# Altium schematic sheet 测试板.SchDoc
size A2
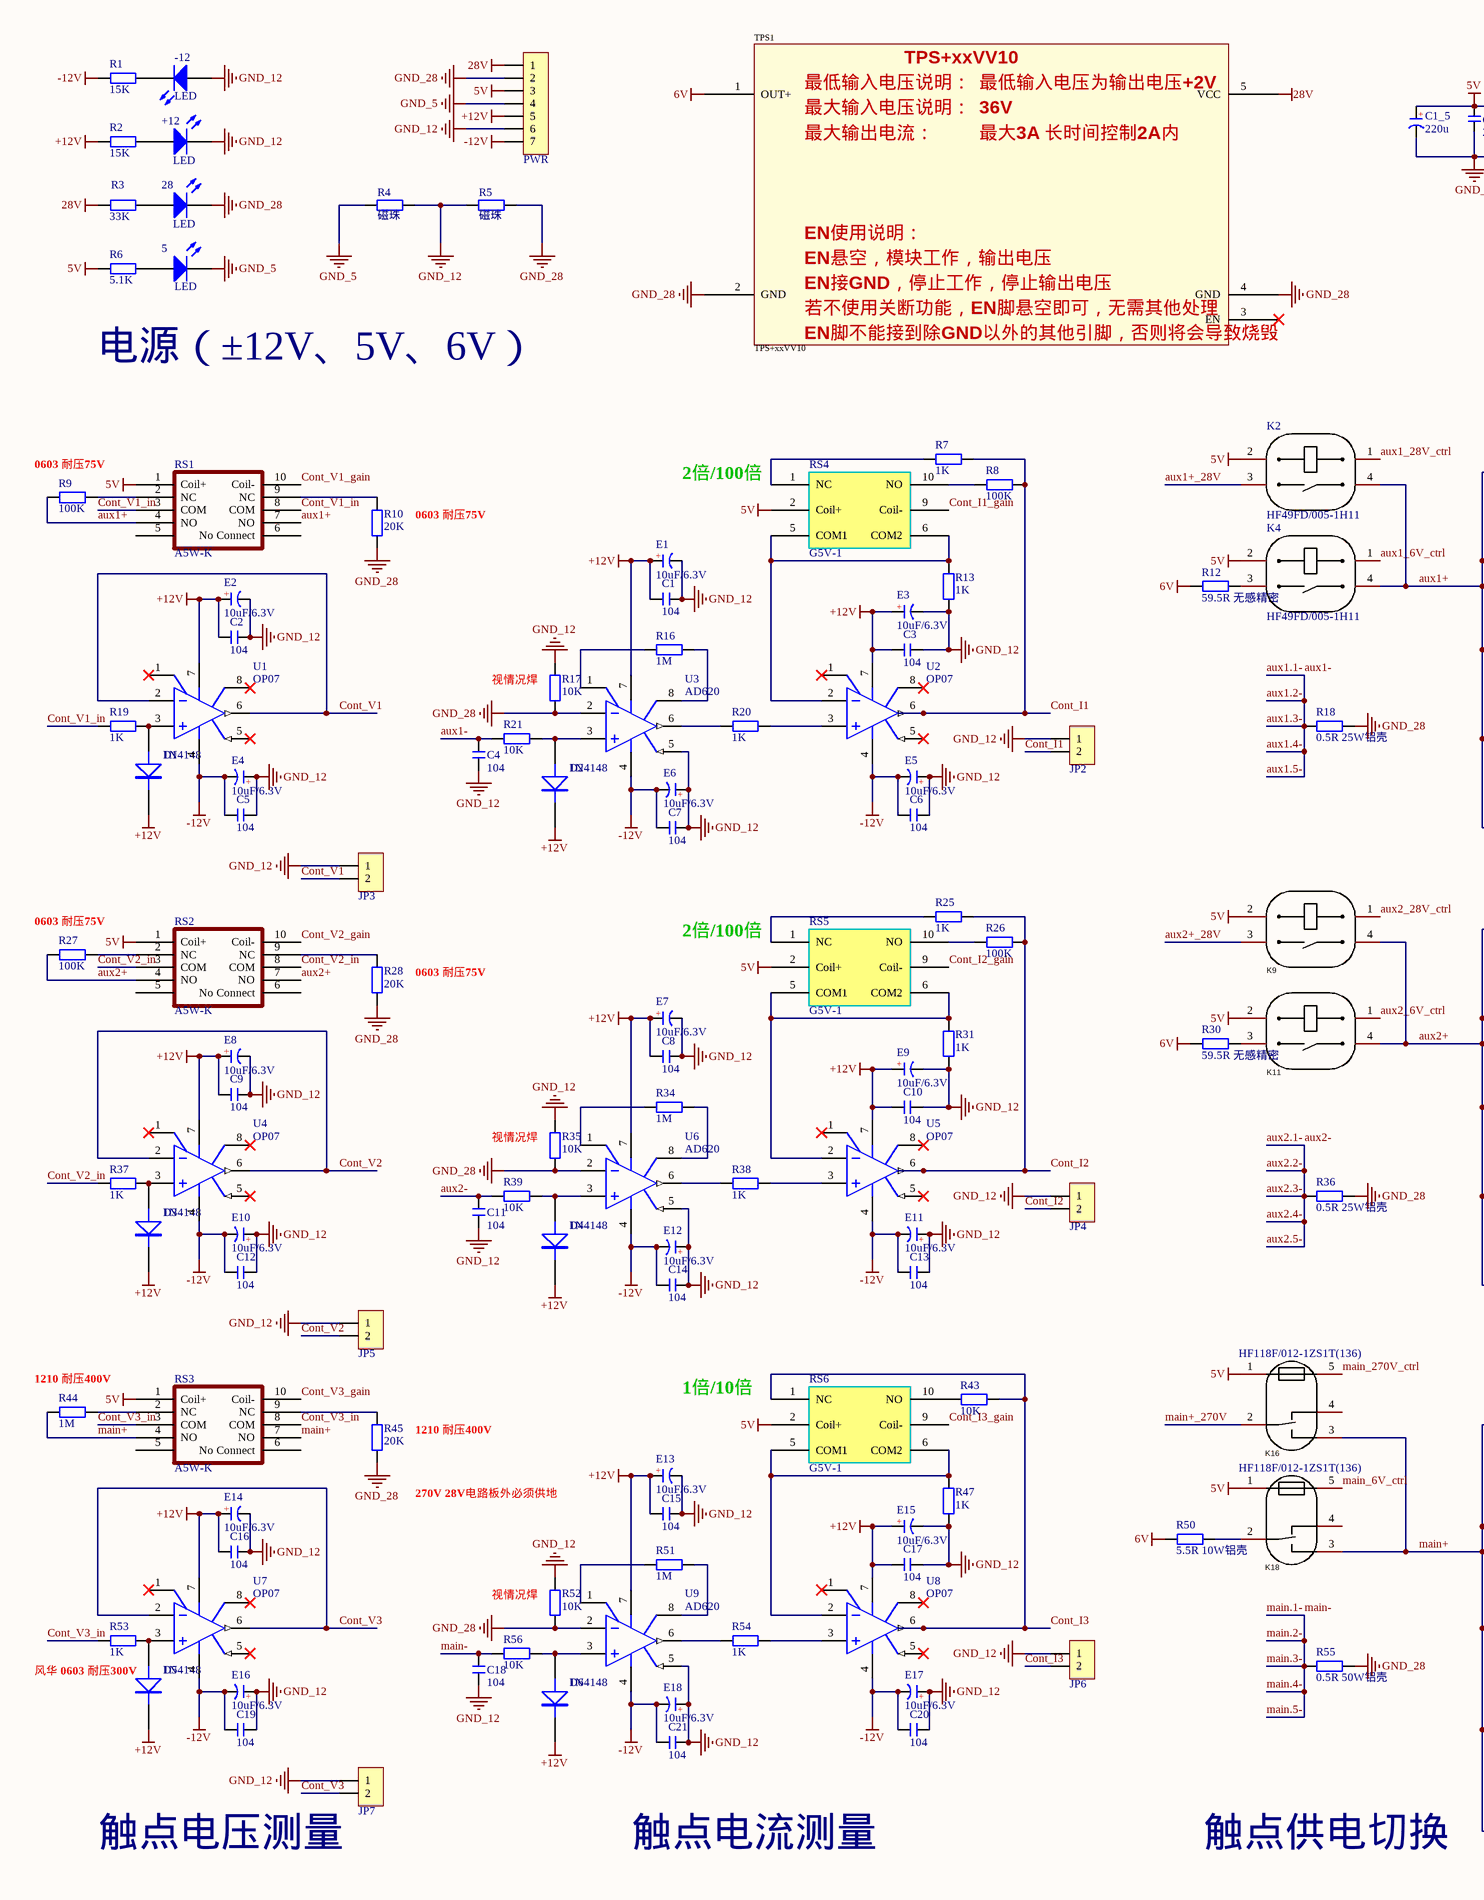
[diagram p0: 测试板.SchDoc, left]
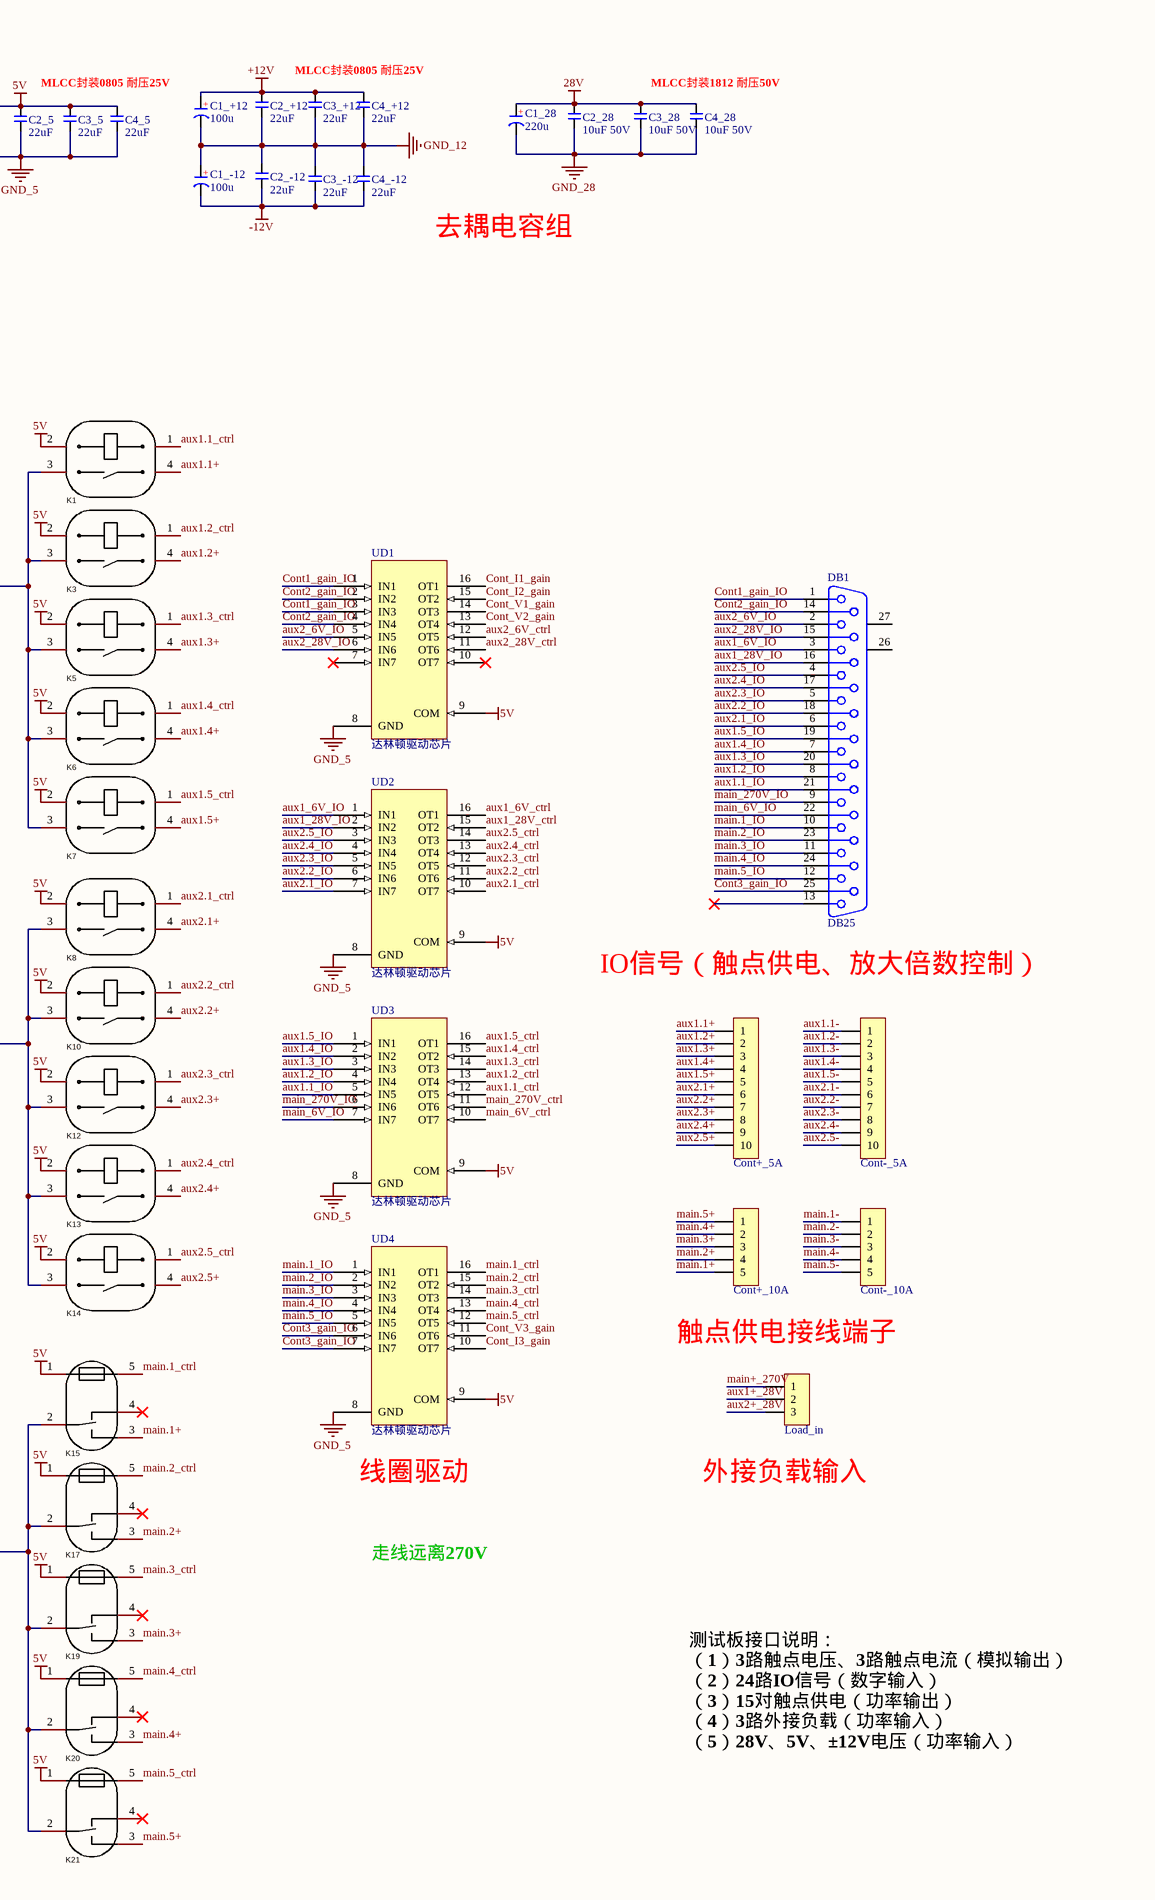
[diagram p1: 测试板.SchDoc, right]

## Parts
5  LED  [LED 0603B]
28  LED  [LED 0603B]
+12  LED  [LED 0603B]
-12  LED  [LED 0603B]
C1  104  [C 0603_L]
C1_5  220u  [CAP 3.5*8*11.5]
C1_28  220u  [CAP 3.5*8*11.5]
C1_+12  100u  [CAP 3.5*8*11.5]
C1_-12  100u  [CAP 3.5*8*11.5]
C2  104  [C 0603_L]
C2_5  Sch Name: 22uF  [C 0805_L]  (hidden comment: xxuF/xxV/Footprint)
C2_28  Sch Name: 10uF 50V  [C 1812_L]  (hidden comment: xxuF/xxV/Footprint)
C2_+12  Sch Name: 22uF  [C 0805_L]  (hidden comment: xxuF/xxV/Footprint)
C2_-12  Sch Name: 22uF  [C 0805_L]  (hidden comment: xxuF/xxV/Footprint)
C3  104  [C 0603_L]
C3_5  Sch Name: 22uF  [C 0805_L]  (hidden comment: xxuF/xxV/Footprint)
C3_28  Sch Name: 10uF 50V  [C 1812_L]  (hidden comment: xxuF/xxV/Footprint)
C3_+12  Sch Name: 22uF  [C 0805_L]  (hidden comment: xxuF/xxV/Footprint)
C3_-12  Sch Name: 22uF  [C 0805_L]  (hidden comment: xxuF/xxV/Footprint)
C4  104  [C 0603_L]
C4_5  Sch Name: 22uF  [C 0805_L]  (hidden comment: xxuF/xxV/Footprint)
C4_28  Sch Name: 10uF 50V  [C 1812_L]  (hidden comment: xxuF/xxV/Footprint)
C4_+12  Sch Name: 22uF  [C 0805_L]  (hidden comment: xxuF/xxV/Footprint)
C4_-12  Sch Name: 22uF  [C 0805_L]  (hidden comment: xxuF/xxV/Footprint)
C5  104  [C 0603_L]
C6  104  [C 0603_L]
C7  104  [C 0603_L]
C8  104  [C 0603_L]
C9  104  [C 0603_L]
C10  104  [C 0603_L]
C11  104  [C 0603_L]
C12  104  [C 0603_L]
C13  104  [C 0603_L]
C14  104  [C 0603_L]
C15  104  [C 0603_L]
C16  104  [C 0603_L]
C17  104  [C 0603_L]
C18  104  [C 0603_L]
C19  104  [C 0603_L]
C20  104  [C 0603_L]
C21  104  [C 0603_L]
Cont+_5A  HDR-1X10  [HT3.96-WI-10P]  (value not drawn)
Cont+_10A  HDR-1X5  [HT3.96-WI-5P]  (value not drawn)
Cont-_5A  HDR-1X10  [HT3.96-WI-10P]  (value not drawn)
Cont-_10A  HDR-1X5  [HT3.96-WI-5P]  (value not drawn)
D1  1N4148  [SOD-323]
D2  1N4148  [SOD-323]
D3  1N4148  [SOD-323]
D4  1N4148  [SOD-323]
D5  1N4148  [SOD-323]
D6  1N4148  [SOD-323]
DB1  DB25  [DB25]
E1  10uF/6.3V  [CD B(3528)]
E2  10uF/6.3V  [CD B(3528)]
E3  10uF/6.3V  [CD B(3528)]
E4  10uF/6.3V  [CD B(3528)]
E5  10uF/6.3V  [CD B(3528)]
E6  10uF/6.3V  [CD B(3528)]
E7  10uF/6.3V  [CD B(3528)]
E8  10uF/6.3V  [CD B(3528)]
E9  10uF/6.3V  [CD B(3528)]
E10  10uF/6.3V  [CD B(3528)]
E11  10uF/6.3V  [CD B(3528)]
E12  10uF/6.3V  [CD B(3528)]
E13  10uF/6.3V  [CD B(3528)]
E14  10uF/6.3V  [CD B(3528)]
E15  10uF/6.3V  [CD B(3528)]
E16  10uF/6.3V  [CD B(3528)]
E17  10uF/6.3V  [CD B(3528)]
E18  10uF/6.3V  [CD B(3528)]
JP2  HDR-1X2  [KF2EDGK-2.54-WI-2P]  (value not drawn)
JP3  HDR-1X2  [KF2EDGK-2.54-WI-2P]  (value not drawn)
JP4  HDR-1X2  [KF2EDGK-2.54-WI-2P]  (value not drawn)
JP5  HDR-1X2  [KF2EDGK-2.54-WI-2P]  (value not drawn)
JP6  HDR-1X2  [KF2EDGK-2.54-WI-2P]  (value not drawn)
JP7  HDR-1X2  [KF2EDGK-2.54-WI-2P]  (value not drawn)
K1  HF49FD/005-1H11  [HF49FD-1H11]  (value not drawn)
K2  HF49FD/005-1H11  [HF49FD-1H11]
K3  HF49FD/005-1H11  [HF49FD-1H11]  (value not drawn)
K4  HF49FD/005-1H11  [HF49FD-1H11]
K5  HF49FD/005-1H11  [HF49FD-1H11]  (value not drawn)
K6  HF49FD/005-1H11  [HF49FD-1H11]  (value not drawn)
K7  HF49FD/005-1H11  [HF49FD-1H11]  (value not drawn)
K8  HF49FD/005-1H11  [HF49FD-1H11]  (value not drawn)
K9  HF49FD/005-1H11  [HF49FD-1H11]  (value not drawn)
K10  HF49FD/005-1H11  [HF49FD-1H11]  (value not drawn)
K11  HF49FD/005-1H11  [HF49FD-1H11]  (value not drawn)
K12  HF49FD/005-1H11  [HF49FD-1H11]  (value not drawn)
K13  HF49FD/005-1H11  [HF49FD-1H11]  (value not drawn)
K14  HF49FD/005-1H11  [HF49FD-1H11]  (value not drawn)
K15  HF118F/012-1ZS1T(136)  [RELAY-TH_HF118F-X-1ZX1X-XXX]  (value not drawn)
K16  HF118F/012-1ZS1T(136)  [RELAY-TH_HF118F-X-1ZX1X-XXX]
K17  HF118F/012-1ZS1T(136)  [RELAY-TH_HF118F-X-1ZX1X-XXX]  (value not drawn)
K18  HF118F/012-1ZS1T(136)  [RELAY-TH_HF118F-X-1ZX1X-XXX]
K19  HF118F/012-1ZS1T(136)  [RELAY-TH_HF118F-X-1ZX1X-XXX]  (value not drawn)
K20  HF118F/012-1ZS1T(136)  [RELAY-TH_HF118F-X-1ZX1X-XXX]  (value not drawn)
K21  HF118F/012-1ZS1T(136)  [RELAY-TH_HF118F-X-1ZX1X-XXX]  (value not drawn)
Load_in  HDR-1X3  [HT3.96-WI-3P]  (value not drawn)
PWR  HDR-1X7  [HT3.96-WI-7P]  (value not drawn)
R1  15K  [R 0603_L]
R2  15K  [R 0603_L]
R3  33K  [R 0603_L]
R4  磁珠  [AXIAL0.4-1/4W]
R5  磁珠  [AXIAL0.4-1/4W]
R6  5.1K  [R 0603_L]
R7  1K  [R 0603_L]
R8  100K  [R 0603_L]
R9  100K  [R 0603_L]
R10  20K  [R 0603_L]
R12  59.5R 无感精密  [无感精密电阻3W]
R13  1K  [R 0603_L]
R16  1M  [R 0603_L]
R17  10K  [R 0603_L]
R18  0.5R 25W铝壳  [黄金铝壳1R25W]
R19  1K  [R 0603_L]
R20  1K  [R 0603_L]
R21  10K  [R 0603_L]
R25  1K  [R 0603_L]
R26  100K  [R 0603_L]
R27  100K  [R 0603_L]
R28  20K  [R 0603_L]
R30  59.5R 无感精密  [无感精密电阻3W]
R31  1K  [R 0603_L]
R34  1M  [R 0603_L]
R35  10K  [R 0603_L]
R36  0.5R 25W铝壳  [黄金铝壳1R25W]
R37  1K  [R 0603_L]
R38  1K  [R 0603_L]
R39  10K  [R 0603_L]
R43  10K  [R 0603_L]
R44  1M  [R 2010_L]
R45  20K  [R 2010_L]
R47  1K  [R 0603_L]
R50  5.5R 10W铝壳  [RX24-10W]
R51  1M  [R 0603_L]
R52  10K  [R 0603_L]
R53  1K  [R 0603_L]
R54  1K  [R 0603_L]
R55  0.5R 50W铝壳  [黄金铝壳0.5R50W]
R56  10K  [R 0603_L]
RS1  A5W-K  [NewA5W_K]
RS2  A5W-K  [NewA5W_K]
RS3  A5W-K  [NewA5W_K]
RS4  G5V-1  [G5V-1]
RS5  G5V-1  [G5V-1]
RS6  G5V-1  [G5V-1]
TPS1  TPS+xxVV10  [TPS+xxVV10模块贴片封装]
U1  OP07  [SOP8]
U2  OP07  [SOP8]
U3  AD620  [SOP8]
U4  OP07  [SOP8]
U5  OP07  [SOP8]
U6  AD620  [SOP8]
U7  OP07  [SOP8]
U8  OP07  [SOP8]
U9  AD620  [SOP8]
UD1  达林顿驱动芯片  [SOP16]
UD2  达林顿驱动芯片  [SOP16]
UD3  达林顿驱动芯片  [SOP16]
UD4  达林顿驱动芯片  [SOP16]

## Nets
5V: C1_5.1(A) C2_5.1 C3_5.1 C4_5.1 K1.2 K2.2 K3.2 K4.2 K5.2 K6.2 K7.2 K8.2 K9.2 K10.2 K11.2 K12.2 K13.2 K14.2 K15.1 K16.1 K17.1 K18.1 K19.1 K20.1 K21.1 PWR.3 R6.2 RS1.1(Coil+) RS2.1(Coil+) RS3.1(Coil+) RS4.2(Coil+) RS5.2(Coil+) RS6.2(Coil+) UD1.9(COM) UD2.9(COM) UD3.9(COM) UD4.9(COM)
6V: R12.1 R30.1 R50.2 TPS1.1(OUT+)
28V: C1_28.1(A) C2_28.1 C3_28.1 C4_28.1 PWR.1 R3.2 TPS1.5(VCC)
+12V: C1.1 C1_+12.1(A) C2.1 C2_+12.1 C3.1 C3_+12.1 C4_+12.1 C8.1 C9.1 C10.1 C15.1 C16.1 C17.1 D1.2(K) D2.2(K) D3.2(K) D4.2(K) D5.2(K) D6.2(K) E1.1(A) E2.1(A) E3.1(A) E7.1(A) E8.1(A) E9.1(A) E13.1(A) E14.1(A) E15.1(A) PWR.5 R2.2 U1.7(V+) U2.7(V+) U3.7(V+) U4.7(V+) U5.7(V+) U6.7(V+) U7.7(V+) U8.7(V+) U9.7(V+)
-12V: C1_-12.2(K) C2_-12.2 C3_-12.2 C4_-12.2 C5.1 C6.1 C7.1 C12.1 C13.1 C14.1 C19.1 C20.1 C21.1 E4.2(K) E5.2(K) E6.2(K) E10.2(K) E11.2(K) E12.2(K) E16.2(K) E17.2(K) E18.2(K) PWR.7 R1.2 U1.4(V-) U2.4(V-) U3.4(V-) U4.4(V-) U5.4(V-) U6.4(V-) U7.4(V-) U8.4(V-) U9.4(V-)
GND_5: 5.2(K) C1_5.2(K) C2_5.2 C3_5.2 C4_5.2 PWR.4 R4.1 UD1.8(GND) UD2.8(GND) UD3.8(GND) UD4.8(GND)
GND_12: +12.2(K) -12.1(A) C1.2 C1_+12.2(K) C1_-12.1(A) C2.2 C2_+12.2 C2_-12.1 C3.2 C3_+12.2 C3_-12.1 C4.1 C4_+12.2 C4_-12.1 C5.2 C6.2 C7.2 C8.2 C9.2 C10.2 C11.1 C12.2 C13.2 C14.2 C15.2 C16.2 C17.2 C18.1 C19.2 C20.2 C21.2 E1.2(K) E2.2(K) E3.2(K) E4.1(A) E5.1(A) E6.1(A) E7.2(K) E8.2(K) E9.2(K) E10.1(A) E11.1(A) E12.1(A) E13.2(K) E14.2(K) E15.2(K) E16.1(A) E17.1(A) E18.1(A) JP2.1 JP3.1 JP4.1 JP5.1 JP6.1 JP7.1 PWR.6 R4.2 R5.1 R13.2 R17.2 R31.2 R35.2 R47.2 R52.2 U3.5(REF) U6.5(REF) U9.5(REF)
GND_28: 28.2(K) C1_28.2(K) C2_28.2 C3_28.2 C4_28.2 PWR.2 R5.2 R10.1 R17.1 R18.1 R28.1 R35.1 R36.1 R45.1 R52.1 R55.1 TPS1.2(GND) TPS1.4(GND) U3.2(-IN) U6.2(-IN) U9.2(-IN)
aux1+: K1.3 K2.4 K3.3 K4.4 K5.3 K6.3 K7.3 R9.1 RS1.4(NO) RS1.7(NO)
aux1+_28V: K2.3 Load_in.2
aux1-: C4.2 Cont-_5A.1 Cont-_5A.2 Cont-_5A.3 Cont-_5A.4 Cont-_5A.5 R18.2 R21.2  [also labelled aux1.1-, aux1.2-, aux1.3-, aux1.4-, aux1.5-]
aux1.1+: Cont+_5A.1 K1.4
aux1.1_ctrl: K1.1 UD3.12(OT5)
aux1.1_IO: DB1.21 UD3.5(IN5)
aux1.2+: Cont+_5A.2 K3.4
aux1.2_ctrl: K3.1 UD3.13(OT4)
aux1.2_IO: DB1.8 UD3.4(IN4)
aux1.3+: Cont+_5A.3 K5.4
aux1.3_ctrl: K5.1 UD3.14(OT3)
aux1.3_IO: DB1.20 UD3.3(IN3)
aux1.4+: Cont+_5A.4 K6.4
aux1.4_ctrl: K6.1 UD3.15(OT2)
aux1.4_IO: DB1.7 UD3.2(IN2)
aux1.5+: Cont+_5A.5 K7.4
aux1.5_ctrl: K7.1 UD3.16(OT1)
aux1.5_IO: DB1.19 UD3.1(IN1)
aux1_6V_ctrl: K4.1 UD2.16(OT1)
aux1_6V_IO: DB1.3 UD2.1(IN1)
aux1_28V_ctrl: K2.1 UD2.15(OT2)
aux1_28V_IO: DB1.16 UD2.2(IN2)
aux2+: K8.3 K9.4 K10.3 K11.4 K12.3 K13.3 K14.3 R27.1 RS2.4(NO) RS2.7(NO)
aux2+_28V: K9.3 Load_in.3
aux2-: C11.2 Cont-_5A.6 Cont-_5A.7 Cont-_5A.8 Cont-_5A.9 Cont-_5A.10 R36.2 R39.2  [also labelled aux2.1-, aux2.2-, aux2.3-, aux2.4-, aux2.5-]
aux2.1+: Cont+_5A.6 K8.4
aux2.1_ctrl: K8.1 UD2.10(OT7)
aux2.1_IO: DB1.6 UD2.7(IN7)
aux2.2+: Cont+_5A.7 K10.4
aux2.2_ctrl: K10.1 UD2.11(OT6)
aux2.2_IO: DB1.18 UD2.6(IN6)
aux2.3+: Cont+_5A.8 K12.4
aux2.3_ctrl: K12.1 UD2.12(OT5)
aux2.3_IO: DB1.5 UD2.5(IN5)
aux2.4+: Cont+_5A.9 K13.4
aux2.4_ctrl: K13.1 UD2.13(OT4)
aux2.4_IO: DB1.17 UD2.4(IN4)
aux2.5+: Cont+_5A.10 K14.4
aux2.5_ctrl: K14.1 UD2.14(OT3)
aux2.5_IO: DB1.4 UD2.3(IN3)
aux2_6V_ctrl: K11.1 UD1.12(OT5)
aux2_6V_IO: DB1.2 UD1.5(IN5)
aux2_28V_ctrl: K9.1 UD1.11(OT6)
aux2_28V_IO: DB1.15 UD1.6(IN6)
Cont1_gain_IO: DB1.1 UD1.1(IN1) UD1.3(IN3)
Cont2_gain_IO: DB1.14 UD1.2(IN2) UD1.4(IN4)
Cont3_gain_IO: DB1.25 UD4.6(IN6) UD4.7(IN7)
Cont_I1: JP2.2 R7.1 R8.1 U2.6(OUT)
Cont_I1_gain: RS4.9(Coil-) UD1.16(OT1)
Cont_I2: JP4.2 R25.1 R26.1 U5.6(OUT)
Cont_I2_gain: RS5.9(Coil-) UD1.15(OT2)
Cont_I3: JP6.2 R43.1 RS6.1(NC) U8.6(OUT)
Cont_I3_gain: RS6.9(Coil-) UD4.10(OT7)
Cont_V1: JP3.2 U1.2(-IN) U1.6(OUT)
Cont_V1_gain: RS1.10(Coil-) UD1.14(OT3)
Cont_V1_in: R19.1 RS1.3(COM) RS1.8(COM)
Cont_V2: JP5.2 U4.2(-IN) U4.6(OUT)
Cont_V2_gain: RS2.10(Coil-) UD1.13(OT4)
Cont_V2_in: R37.1 RS2.3(COM) RS2.8(COM)
Cont_V3: JP7.2 U7.2(-IN) U7.6(OUT)
Cont_V3_gain: RS3.10(Coil-) UD4.11(OT6)
Cont_V3_in: R53.1 RS3.3(COM) RS3.8(COM)
main+: K15.2 K16.3 K17.2 K18.3 K19.2 K20.2 K21.2 R44.1 RS3.4(NO) RS3.7(NO)
main+_270V: K16.2 Load_in.1
main-: C18.2 Cont-_10A.1 Cont-_10A.2 Cont-_10A.3 Cont-_10A.4 Cont-_10A.5 R55.2 R56.2  [also labelled main.1-, main.2-, main.3-, main.4-, main.5-]
main.1+: Cont+_10A.5 K15.3
main.1_ctrl: K15.5 UD4.16(OT1)
main.1_IO: DB1.10 UD4.1(IN1)
main.2+: Cont+_10A.4 K17.3
main.2_ctrl: K17.5 UD4.15(OT2)
main.2_IO: DB1.23 UD4.2(IN2)
main.3+: Cont+_10A.3 K19.3
main.3_ctrl: K19.5 UD4.14(OT3)
main.3_IO: DB1.11 UD4.3(IN3)
main.4+: Cont+_10A.2 K20.3
main.4_ctrl: K20.5 UD4.13(OT4)
main.4_IO: DB1.24 UD4.4(IN4)
main.5+: Cont+_10A.1 K21.3
main.5_ctrl: K21.5 UD4.12(OT5)
main.5_IO: DB1.12 UD4.5(IN5)
main_6V_ctrl: K18.5 UD3.10(OT7)
main_6V_IO: DB1.22 UD3.7(IN7)
main_270V_ctrl: K16.5 UD3.11(OT6)
main_270V_IO: DB1.9 UD3.6(IN6)
Net5_1: 5.1(A) R6.1
Net28_1: 28.1(A) R3.1
Net+12_1: +12.1(A) R2.1
Net-12_2: -12.2(K) R1.1
NetD1_1: D1.1(A) R19.2 U1.3(+IN)
NetD2_1: D2.1(A) R21.1 U3.3(+IN)
NetD3_1: D3.1(A) R37.2 U4.3(+IN)
NetD4_1: D4.1(A) R39.1 U6.3(+IN)
NetD5_1: D5.1(A) R53.2 U7.3(+IN)
NetD6_1: D6.1(A) R56.1 U9.3(+IN)
NetK4_3: K4.3 R12.2
NetK11_3: K11.3 R30.2
NetK18_2: K18.2 R50.1
NetR7_2: R7.2 RS4.1(NC)
NetR8_2: R8.2 RS4.10(NO)
NetR9_2: R9.2 RS1.2(NC)
NetR10_2: R10.2 RS1.9(NC)
NetR13_1: R13.1 RS4.5(COM1) RS4.6(COM2) U2.2(-IN)
NetR16_1: R16.1 U3.8(RG)
NetR16_2: R16.2 U3.1(RG)
NetR20_1: R20.1 U3.6(OUT)
NetR20_2: R20.2 U2.3(+IN)
NetR25_2: R25.2 RS5.1(NC)
NetR26_2: R26.2 RS5.10(NO)
NetR27_2: R27.2 RS2.2(NC)
NetR28_2: R28.2 RS2.9(NC)
NetR31_1: R31.1 RS5.5(COM1) RS5.6(COM2) U5.2(-IN)
NetR34_1: R34.1 U6.8(RG)
NetR34_2: R34.2 U6.1(RG)
NetR38_1: R38.1 U6.6(OUT)
NetR38_2: R38.2 U5.3(+IN)
NetR43_2: R43.2 RS6.10(NO)
NetR44_2: R44.2 RS3.2(NC)
NetR45_2: R45.2 RS3.9(NC)
NetR47_1: R47.1 RS6.5(COM1) RS6.6(COM2) U8.2(-IN)
NetR51_1: R51.1 U9.8(RG)
NetR51_2: R51.2 U9.1(RG)
NetR54_1: R54.1 U9.6(OUT)
NetR54_2: R54.2 U8.3(+IN)

Not connected (* = marked no-connect by the designer): DB1 13* 26(MH1) 27(MH2); K15 4*; K16 4; K17 4*; K18 4; K19 4*; K20 4*; K21 4*; RS1 5(No_Connect) 6(No_Connect); RS2 5(No_Connect) 6(No_Connect); RS3 5(No_Connect) 6(No_Connect); TPS1 3(EN)*; U1 1(RG)* 5(REF)* 8(RG)*; U2 1(RG)* 5(REF)* 8(RG)*; U4 1(RG)* 5(REF)* 8(RG)*; U5 1(RG)* 5(REF)* 8(RG)*; U7 1(RG)* 5(REF)* 8(RG)*; U8 1(RG)* 5(REF)* 8(RG)*; UD1 7(IN7)* 10(OT7)*

## Notes on the sheet
- MLCC封装0805 耐压25V
- MLCC封装1812 耐压50V
- 去耦电容组
- 电源（±12V、5V、6V）
- (near R9) 0603 耐压75V
- 2倍/100倍
- (near R10) 0603 耐压75V
- 视情况焊
- (near R27) 0603 耐压75V
- (near R28) 0603 耐压75V
- IO信号（触点供电、放大倍数控制）
- 触点供电接线端子
- (near R44) 1210 耐压400V
- (near R45) 1210 耐压400V
- 1倍/10倍
- 270V 28V电路板外必须供地
- (near UD4) 线圈驱动
- (near Load_in) 外接负载输入
- 走线远离270V
- 风华 0603 耐压300V
- 测试板接口说明：
  （1）3路触点电压、3路触点电流（模拟输出）
  （2）24路IO信号（数字输入）
  （3）15对触点供电（功率输出）
  （4）3路外接负载（功率输入）
  （5）28V、5V、±12V电压（功率输入）
- 触点电压测量
- 触点电流测量
- 触点供电切换
- (in symbol CT) +
- (in symbol T_CAP) +
- (in symbol TPS+xxVV10) 最低输入电压说明：; 最低输入电压为输出电压+2V; 最大输入电压说明：; 36V; 最大输出电流：; 最大3A 长时间控制2A内; EN使用说明：; EN悬空，模块工作，输出电压; EN接GND，停止工作，停止输出电压; 若不使用关断功能，EN脚悬空即可，无需其他处理; EN脚不能接到除GND以外的其他引脚，否则将会导致烧毁

## Library data of the parts
5 28 +12 -12 = LED3: Typical BLUE SiC LED; Published: 8-Jun-2000; LatestRevisionDate: 17-Dec-2003; LatestRevisionNote: PCB Footprint replaced.; DatasheetVersion: 16-Apr-2002; PackageVersion: 16-Apr-2002; PackageReference: 3.5X2.8X1.9; Publisher: Altium Limited
C1-C21 = C: 贴片电容; BOM名称: 无极性贴片电容; 淘宝ID: 封装库来自淘宝 ID：黄晶宝石; 联系售后，技术支持: https://shop463601444.taobao.com; 唯一出售店铺网址: https://shop463601444.taobao.com
C1_5 C1_28 C1_+12 C1_-12 = T_CAP: Tantalum capacitor
C2_5 C2_28 C2_+12 C2_-12 C3_5 C3_28 C3_+12 C3_-12 C4_5 C4_28 C4_+12 C4_-12 = CAP MLCC: Manufacture: xxuF/xxV/Footprint
Cont+_5A Cont-_5A = Header 10: 10P接插件; BOM名称: 10P接插件; 学习资源: https://shop463601444.taobao.com
Cont+_10A Cont-_10A = Header 5: 5P接插件; 版权归属: 封装库来自淘宝卖家 ID：黄晶宝石; BOM名称: 5P接插件; 学习资源: https://shop463601444.taobao.com
D1-D6 = DIODE
DB1 = D Connector 25: Receptacle Assembly, 25 Position, Right Angle; PackageDocument: U; Positions: 25; Published: 15-Jun-2001; LatestRevisionDate: 17-Jul-2002; LatestRevisionNote: Re-released for DXP Platform.; DatasheetDocument: 19-Mar-1999; PackageReference: 787202; Publisher: Altium Limited; Orientation: Right Angle; Gender: Receptacle
E1-E18 = CT: 贴片钽电容; 淘宝ID: 封装库来自淘宝 ID：黄晶宝石; BOM名称: 贴片钽电容; 联系售后: https://item.taobao.com/item.htm?id=566775463719
JP2-JP7 = Header 2: 2P接插件; 版权归属: 封装库来自淘宝 ID：黄晶宝石; BOM名称: 2P接插件; 联系售后: https://shop463601444.taobao.com
K1-K14 = HF49FD/005-1H11: Manufacturer: HF(宏发); Add into BOM: yes; Coil Voltage: 5V; Contact Form: 一组常开:1A(单刀单掷-常开); Pin Number: 4; Contact Rating: 5A@30VDC；5A@250VAC; Maximum Switching Voltage: 250V@AC；30V@DC; Coil Rated Power: 120mW; Maximum Switching Current: 5A; Coil Type: 无极性-单线圈; Coil Resistance: 208Ω; Contact Resistance: 100mΩ; Operate Time: 10ms; Release Time: 5ms; Symbol: HF49FD/005-1H11; Device: HF49FD/005-1H11; Supplier: LCSC; Manufacturer Part: HF49FD/005-1H11; Supplier Part: C28975; JLCPCB Part Class: Extended Part; LCSC Part Name: 白色; Supplier Footprint: SIP,5x20mm; Datasheet: https://atta.szlcsc.com/upload/public/pdf/source/20141025/1457707244162.pdf; Convert to PCB: yes; Contact Material: AgNi; Operating Temperature: -40℃~+85℃
K15-K21 = HF118F/012-1ZS1T(136): Manufacturer: HF(宏发); Add into BOM: yes; Coil Voltage: 12V; Coil Type: 非极化-单线圈; Pin Number: 5; Contact Form: 一组转换:1C(单刀双掷-转换); Maximum Switching Current: 8A; Maximum Switching Voltage: 125V@DC；440V@AC; Coil Rated Power: 220mW; Coil Resistance: 620Ω; Operate Time: 10ms; Release Time: 5ms; Contact Resistance: 100mΩ; Symbol: HF118F/012-1ZS1T(136); Device: HF118F/012-1ZS1T(136); LCSC Part Name: 小型大功率12V继电器 单刀双掷; Supplier Part: C358641; Manufacturer Part: HF118F/012-1ZS1T(136); Supplier Footprint: 插件,10.1x28.5mm; JLCPCB Part Class: Extended Part; Datasheet: https://atta.szlcsc.com/upload/public/pdf/source/20190107/C358641_5A7D4A3B2467D8D31036A88FB71A67BA.pdf; Supplier: LCSC; Convert to PCB: yes; Contact Material: AgSnO2; Operating Temperature: -40℃~+85℃
Load_in = Header 3: 3P接插件; 版权归属: 封装库来自淘宝卖家 ID：黄晶宝石; BOM名称: 3P接插件; 学习资源: https://shop463601444.taobao.com
PWR = Header 7: 7P接插件; 版权归属: 封装库来自淘宝卖家 ID：黄晶宝石; BOM名称: 7P接插件; 学习资源: https://shop463601444.taobao.com
R1-R3 R6-R10 R12 R13 R16-R21 R25-R28 R30 R31 R34-R39 R43-R45 R47 R50-R56 = R: 贴片电阻; 版权归属: 来自淘宝 ID：黄晶宝石; 封装库来自淘宝卖家 ID：黄晶宝石: 其他店铺购入均为盗版，不享受售后技术支持服务，请立即申请退款; BOM名称: 贴片电阻; 联系售后: https://item.taobao.com/item.htm?id=566775463719
R4 R5 = Res2: Resistor; Value: 1K; Published: 8-Jun-2000; LatestRevisionDate: 17-Jul-2002; LatestRevisionNote: Re-released for DXP Platform.; PackageReference: AXIAL-0.4; Publisher: Altium Limited; PackageDescription: Axial Device, Thru-Hole; 2 Leads; 0.4 in Pin Spacing
RS1-RS3 = Relay
U1-U9 = AD620AR (8): Precision Instrumentation Amplifier
UD1-UD4 = ULN2003: 学习资源: 最新版本发布https://item.taobao.com/item.htm?id=566775463719